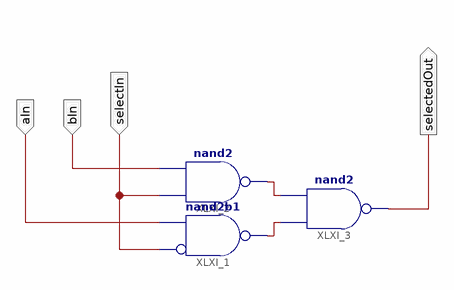
[diagram p0: schematic sheet 1]
// Xilinx ISE schematic Mux2x1.sch (spartan3e) as structural Verilog: 3 symbols, 4 ports
module Mux2x1 (
  input  aIn,
  input  bIn,
  input  selectIn,
  output selectedOut
);

  wire XLXN_4, XLXN_5;

  nand XLXI_1 (XLXN_4, ~selectIn, aIn);  // nand2b1
  nand XLXI_2 (XLXN_5, selectIn, bIn);
  nand XLXI_3 (selectedOut, XLXN_4, XLXN_5);
endmodule
